# Altium schematic sheet 2403_HDD_ROM_Emulator.SchDoc: HDD 16bit ROM Emulator
size A4; DrawnBy: SY; Engineer: SY; Organization: R.LAB; DocumentNumber: 2403; Revision: 1; SheetNumber: 1; SheetTotal: 3
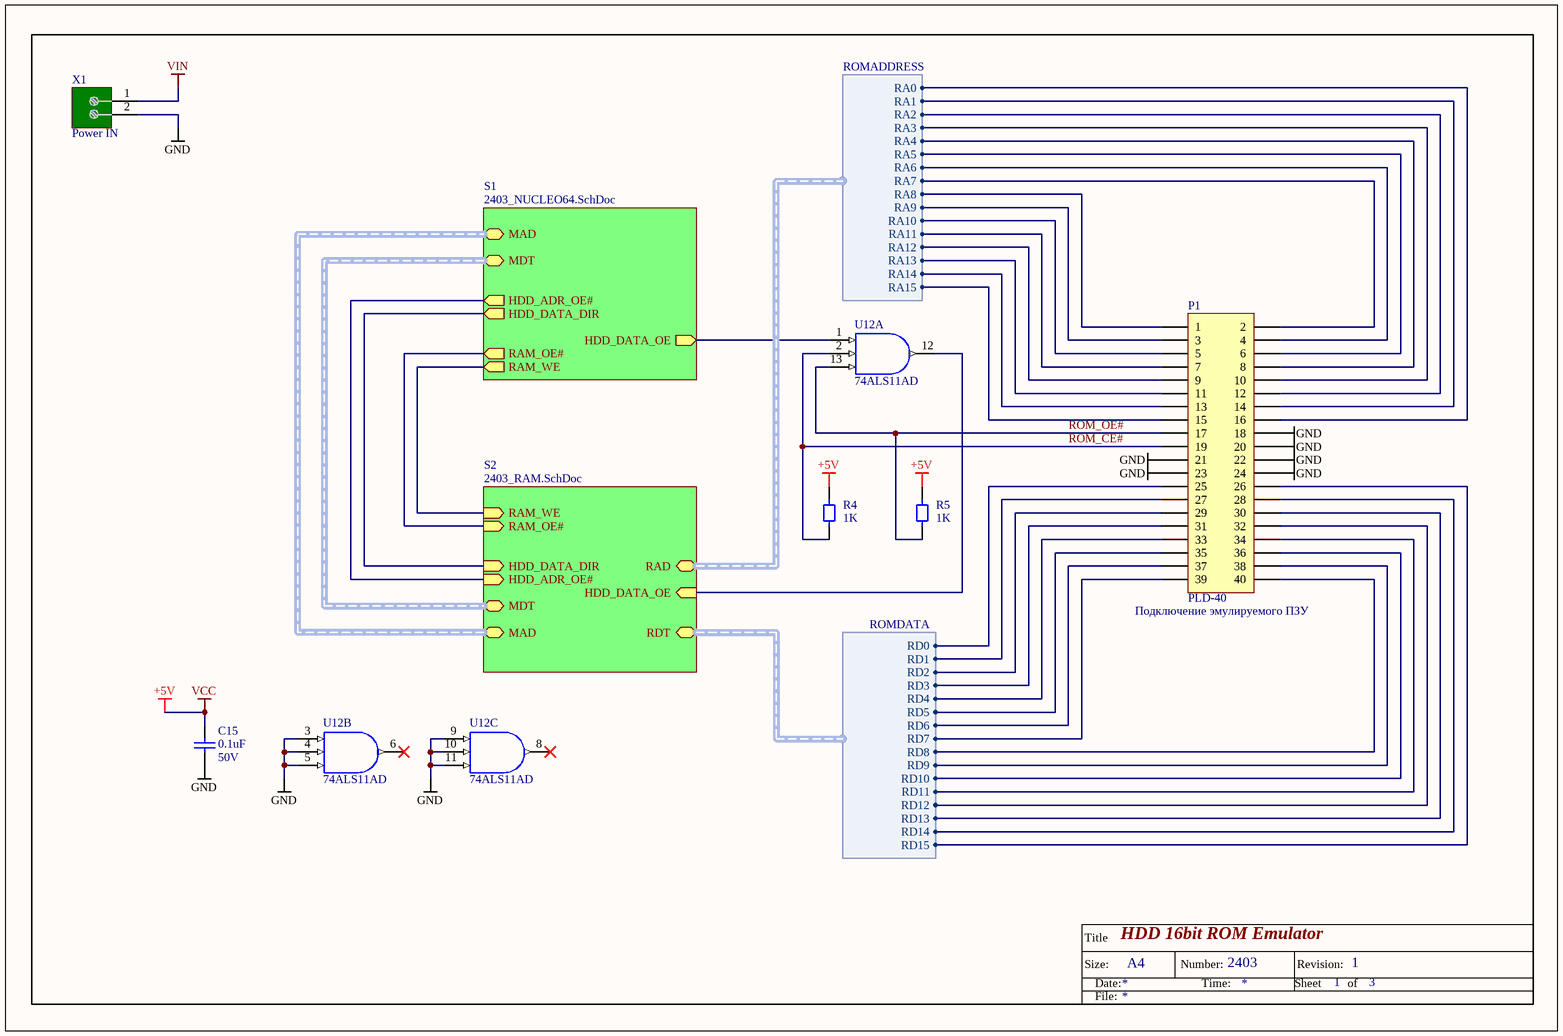
[diagram p0: 2403_HDD_ROM_Emulator.SchDoc]

## Parts
C15  0.1uF  Rated Voltage: 50V  [0805_CAPC2013X100N]
P1  PLD-40  [PLD40_3M_2540-6002RB]
R4  1K  [0805_RESC2013X84N]
R5  1K  [0805_RESC2013X84N]
U12  74ALS11AD  [DIP14-300]  (parts A,B,C of 3)
X1  ConnectionName: Power IN  [PHOENIX_3.5mm]  (hidden comment: DG306-5.0 2)

## Sub-sheets
S1 = 2403_NUCLEO64.SchDoc: MAD (harness MCUADDR), MDT (harness MCUDAT), HDD_ADR_OE# (out), HDD_DATA_DIR (out), HDD_DATA_OE (out), RAM_WE (out), RAM_OE# (out)
S2 = 2403_RAM.SchDoc: RDT (harness ROMDATA), RAD (harness ROMADDRESS), MAD (harness MCUADDR), MDT (harness MCUDAT), HDD_ADR_OE# (in), HDD_DATA_DIR (in), HDD_DATA_OE (in), RAM_OE# (in), RAM_WE (in)

## Harnesses
ROMDATA: RD0, RD1, RD2, RD3, RD4, RD5, RD6, RD7, RD8, RD9, RD10, RD11, RD12, RD13, RD14, RD15
ROMADDRESS: RA0, RA1, RA2, RA3, RA4, RA5, RA6, RA7, RA8, RA9, RA10, RA11, RA12, RA13, RA14, RA15

## Nets
+5V: C15.2 R4.2 R5.2 U12.14(VCC)  [also labelled VCC]
GND: C15.1 P1.18 P1.20 P1.21 P1.22 P1.23 P1.24 U12.3(A) U12.4(B) U12.5(C) U12.7(GND) U12.9(A) U12.10(B) U12.11(C) X1.2
VIN: X1.1
ROM_CE#: P1.19 R4.1 U12.2(B)
ROM_OE#: P1.17 R5.1 U12.13(C)
NetP1_1: P1.1 ; sheet S2/RAD.RA8
NetP1_2: P1.2 ; sheet S2/RAD.RA7
NetP1_3: P1.3 ; sheet S2/RAD.RA9
NetP1_4: P1.4 ; sheet S2/RAD.RA6
NetP1_5: P1.5 ; sheet S2/RAD.RA10
NetP1_6: P1.6 ; sheet S2/RAD.RA5
NetP1_7: P1.7 ; sheet S2/RAD.RA11
NetP1_8: P1.8 ; sheet S2/RAD.RA4
NetP1_9: P1.9 ; sheet S2/RAD.RA12
NetP1_10: P1.10 ; sheet S2/RAD.RA3
NetP1_11: P1.11 ; sheet S2/RAD.RA13
NetP1_12: P1.12 ; sheet S2/RAD.RA2
NetP1_13: P1.13 ; sheet S2/RAD.RA14
NetP1_14: P1.14 ; sheet S2/RAD.RA1
NetP1_15: P1.15 ; sheet S2/RAD.RA15
NetP1_16: P1.16 ; sheet S2/RAD.RA0
NetP1_25: P1.25 ; sheet S2/RDT.RD0
NetP1_26: P1.26 ; sheet S2/RDT.RD15
NetP1_27: P1.27 ; sheet S2/RDT.RD1
NetP1_28: P1.28 ; sheet S2/RDT.RD14
NetP1_29: P1.29 ; sheet S2/RDT.RD2
NetP1_30: P1.30 ; sheet S2/RDT.RD13
NetP1_31: P1.31 ; sheet S2/RDT.RD3
NetP1_32: P1.32 ; sheet S2/RDT.RD12
NetP1_33: P1.33 ; sheet S2/RDT.RD4
NetP1_34: P1.34 ; sheet S2/RDT.RD11
NetP1_35: P1.35 ; sheet S2/RDT.RD5
NetP1_36: P1.36 ; sheet S2/RDT.RD10
NetP1_37: P1.37 ; sheet S2/RDT.RD6
NetP1_38: P1.38 ; sheet S2/RDT.RD9
NetP1_39: P1.39 ; sheet S2/RDT.RD7
NetP1_40: P1.40 ; sheet S2/RDT.RD8
NetU12_1: U12.1(A) ; sheet S1/HDD_DATA_OE
NetU12_12: U12.12(Y) ; sheet S2/HDD_DATA_OE
(unnamed): sheet S1/HDD_ADR_OE#, sheet S2/HDD_ADR_OE#
(unnamed): sheet S1/HDD_DATA_DIR, sheet S2/HDD_DATA_DIR
(unnamed): sheet S1/RAM_WE, sheet S2/RAM_WE
(unnamed): sheet S1/RAM_OE#, sheet S2/RAM_OE#

Not connected (* = marked no-connect by the designer): U12 6(Y)* 8(Y)*

## Buses and harness runs
harness sheet S1/MAD = sheet S2/MAD
harness sheet S1/MDT = sheet S2/MDT

## Notes on the sheet
- (near P1) Подключение эмулируемого ПЗУ
- Title
- Size:
- Date:
- A4
- Number:
- Time:
- Sheet
- Revision:
- of
- File:

## Library data of the parts
C15 = Cap SMD: Capacitor SMD; Suppler: chips; VALUE: 0.1uF; PackageReference: 0805; Publisher: SY; Price: 1
P1 = PLD-40: 40pin 2.54mm pitch plug; Suppler: PP; Publisher: SY; Price: ?; Source: 2403
R4 R5 = Resistor SMD L: SMD Resistor; Tolerance: 5%; Power: 0.1W; VALUE: 1K; Publisher: SY; Price: *; Suppler: *; Package: 0805
U12 = 74ALS11AD: К1533ЛИ3 Triple 3-Input Positive-AND Gate; Suppler: RR; Price: ?; Publisher: SY; Source: 2403_HDD_ROM_Emulator
X1 = CON_Plug2: 2pin connector; Suppler: promelec; Publisher: SY; Price: 5?